# EAGLE design Schemat (EAGLE 9.1.0)
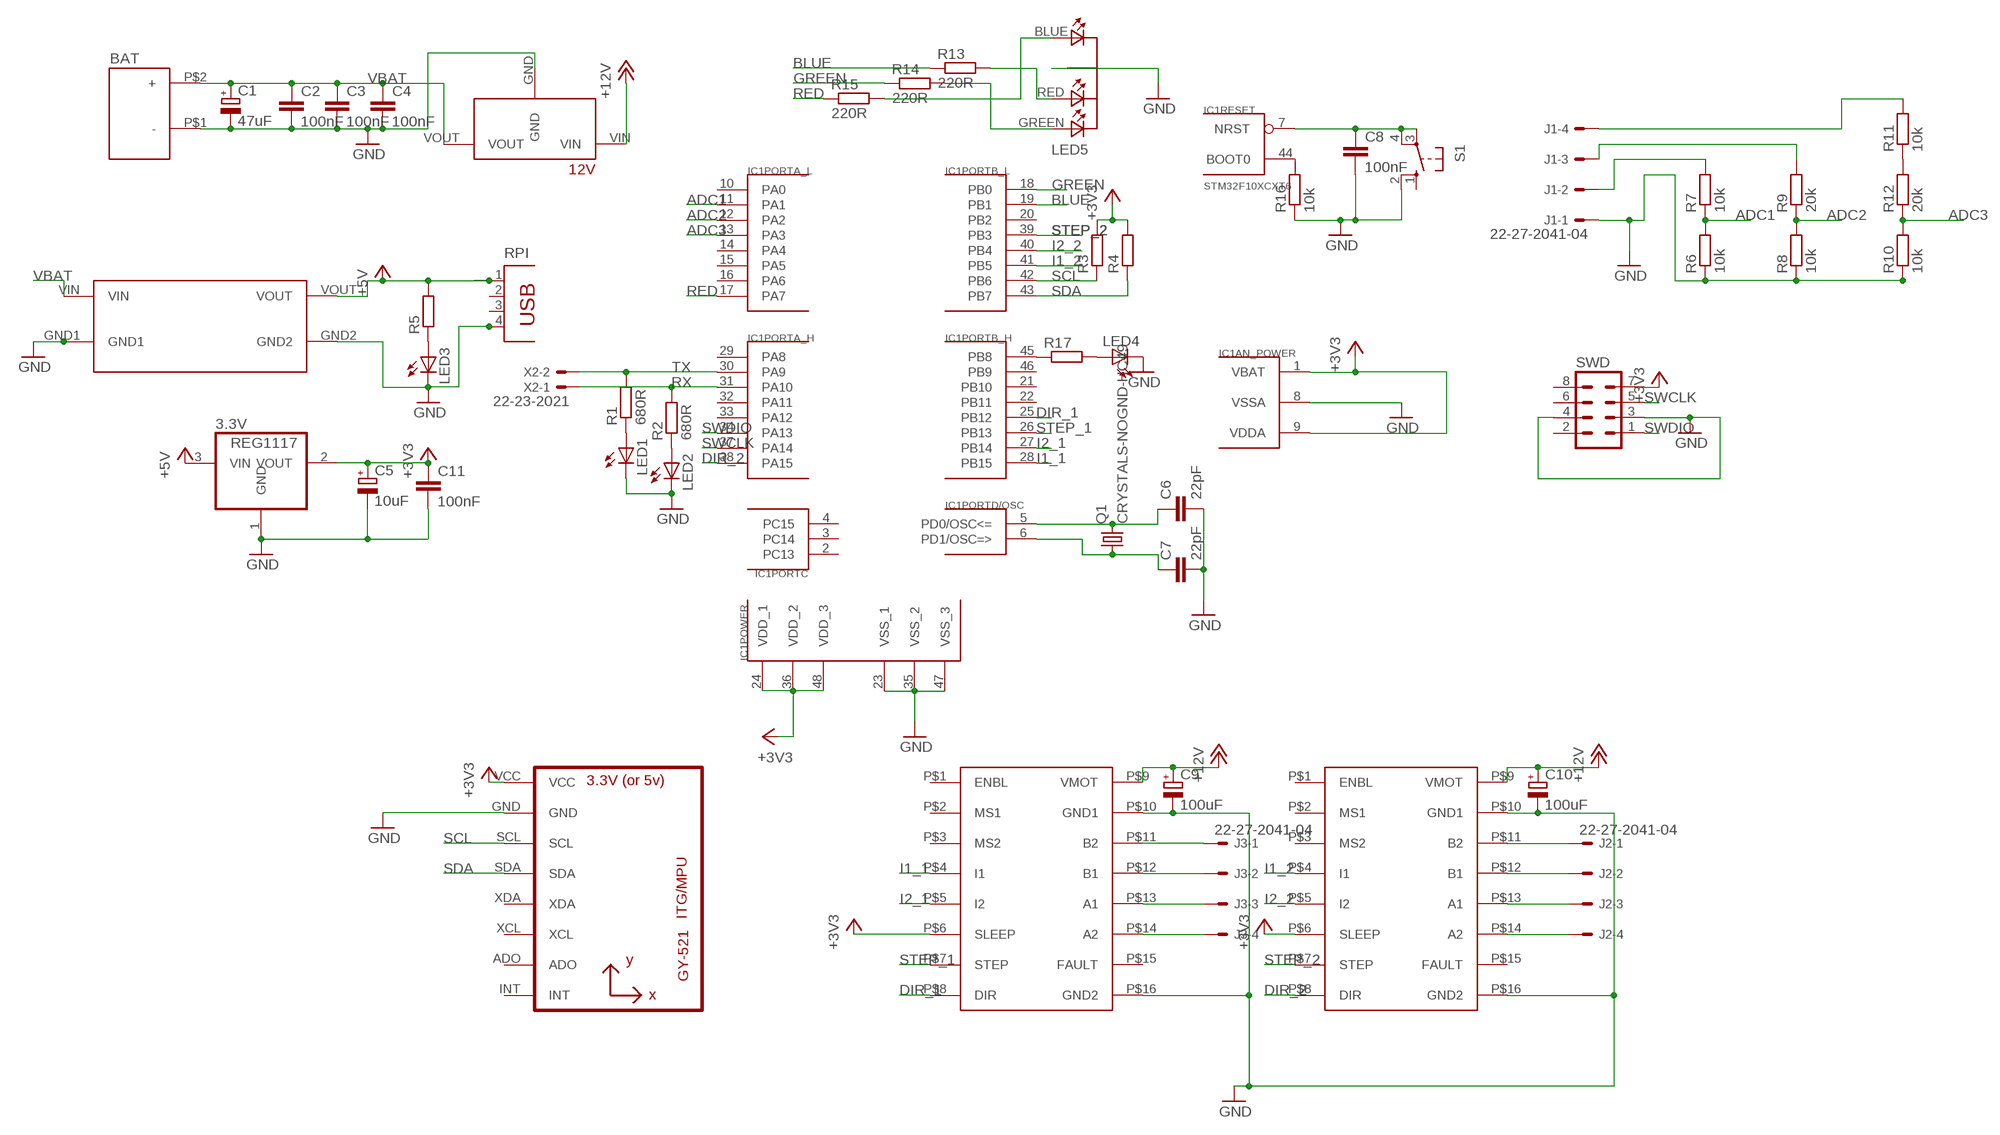
[diagram p0: schematic, sheet 1]

## Parts
3.3V  REG1117  [SOT223]
12V  12V_VOLTAGE_REGULATOR  9V_VOLTAGE_REGULATOR  [9V_VOLTAGE_REGULATOR]
BAT  DEANS  [DEAN]
C1  47uF  CPOL-EUE2-5  [E2-5]
C2  100nF  C-EUC0603K  [C0603K]
C3  100nF  C-EUC0603K  [C0603K]
C4  100nF  C-EUC0603K  [C0603K]
C5  10uF  CPOL-EUE2-5  [E2-5]
C6  22pF  C-EUC0603K  [C0603K]
C7  22pF  C-EUC0603K  [C0603K]
C8  100nF  C-EU050-030X075  [C050-030X075]
C9  100uF  CPOL-EUE2.5-7  [E2,5-7]
C10  100uF  CPOL-EUE2.5-7  [E2,5-7]
C11  100nF  C-EUC0603  [C0603]
DRV1  POLOLU-MP6500  [STEPPER-CARRIER]
DRV2  POLOLU-MP6500  [STEPPER-CARRIER]
IC1  STM32F10XCXT6  [TQFP48]
J1  22-27-2041-04  [6410-04]
J2  22-27-2041-04  [6410-04]
J3  22-27-2041-04  [6410-04]
LED1  LEDSML0603  [SML0603]
LED2  LEDSML0603  [SML0603]
LED3  LED5MM  [LED5MM]
LED4  LED5MM  [LED5MM]
LED5  LED-DIP-3  [DIP-4]
Q1  CRYSTALS-NOGND-HC49  [HC49]
R1  680R  R-EU_R0805  [R0805]
R2  680R  R-EU_R0805  [R0805]
R3  R-EU_R0805  [R0805]
R4  R-EU_R0805  [R0805]
R5  R-EU_R0805  [R0805]
R6  10k  R-EU_R0805  [R0805]
R7  10k  R-EU_R0805  [R0805]
R8  10k  R-EU_R0805  [R0805]
R9  20k  R-EU_R0805  [R0805]
R10  10k  R-EU_R0805  [R0805]
R11  10k  R-EU_R0805  [R0805]
R12  20k  R-EU_R0805  [R0805]
R13  220R  R-EU_R0805  [R0805]
R14  220R  R-EU_R0805  [R0805]
R15  220R  R-EU_R0805  [R0805]
R16  10k  R-EU_R0805  [R0805]
R17  R-EU_R0805  [R0805]
RPI  PN87520  [PN87520]
S1  10-XX  [B3F-10XX]
SWD  MA04-2  [MA04-2]
U1  GY-521MPU6050  [GY-521]
U$1  DC-DC  [DC-DC]
X2  22-23-2021  [22-23-2021]

## Nets
+3V3: 3.3V.2(VOUT) C5.+ C11.1 DRV1.P$6(SLEEP) DRV2.P$6(SLEEP) IC1.1(AN_POWER:VBAT) IC1.9(AN_POWER:VDDA) IC1.24(POWER:VDD_1) IC1.36(POWER:VDD_2) IC1.48(POWER:VDD_3) R3.2 R4.2 SWD.7 U1.VCC
+5V: 3.3V.3(VIN) R5.2 RPI.1 U$1.VOUT
+12V: 12V.VIN C9.+ C10.+ DRV1.P$9(VMOT) DRV2.P$9(VMOT)
ADC1: IC1.11(PORTA_L:PA1) R6.2 R7.1
ADC2: IC1.12(PORTA_L:PA2) R8.2 R9.1
ADC3: IC1.13(PORTA_L:PA3) R10.2 R12.1
BLUE: IC1.19(PORTB_L:PB1) R13.1
DIR_1: DRV1.P$8(DIR) IC1.25(PORTB_H:PB12)
DIR_2: DRV2.P$8(DIR) IC1.38(PORTA_H:PA15)
GND: 3.3V.1(GND) 12V.GND BAT.P$1(-) C1.- C2.2 C3.2 C4.2 C5.- C6.2 C7.2 C8.2 C9.- C10.- C11.2 DRV1.P$10(GND1) DRV1.P$16(GND2) DRV2.P$10(GND1) DRV2.P$16(GND2) IC1.8(AN_POWER:VSSA) IC1.23(POWER:VSS_1) IC1.35(POWER:VSS_2) IC1.47(POWER:VSS_3) J1.1 LED1.C LED2.C LED3.K(C) LED4.K(C) LED5.COMMON_CATHODE(COM-CATHODE) R6.1 R8.1 R10.1 R16.1 RPI.4 S1.2(S1) SWD.3 SWD.4 U1.GND U$1.GND1 U$1.GND2
GREEN: IC1.18(PORTB_L:PB0) R14.1
I1_1: DRV1.P$4(I1) IC1.28(PORTB_H:PB15)
I1_2: DRV2.P$4(I1) IC1.41(PORTB_L:PB5)
I2_1: DRV1.P$5(I2) IC1.27(PORTB_H:PB14)
I2_2: DRV2.P$5(I2) IC1.40(PORTB_L:PB4)
N$1: LED1.A R1.1
N$2: LED2.A R2.1
N$3: IC1.44(RESET:BOOT0) R16.2
N$4: C7.1 IC1.6(PORTD/OSC:PD1/OSC=>) Q1.1
N$5: LED5.GREEN R14.2
N$6: J1.2 R7.2
N$7: LED3.A R5.1
N$8: J1.3 R9.2
N$9: R11.1 R12.2
N$10: J1.4 R11.2
N$11: C8.1 IC1.7(RESET:NRST) S1.3(P) S1.4(P1)
N$13: IC1.45(PORTB_H:PB8) R17.1
N$14: LED4.A R17.2
N$15: LED5.RED R13.2
N$16: DRV2.P$11(B2) J2.1
N$17: LED5.BLUE R15.2
N$18: DRV1.P$12(B1) J3.2
N$19: DRV2.P$12(B1) J2.2
N$20: DRV2.P$13(A1) J2.3
N$21: DRV2.P$14(A2) J2.4
N$22: DRV1.P$11(B2) J3.1
N$23: DRV1.P$13(A1) J3.3
N$24: DRV1.P$14(A2) J3.4
N$26: C6.1 IC1.5(PORTD/OSC:PD0/OSC<=) Q1.2
RED: IC1.17(PORTA_L:PA7) R15.1
RX: IC1.31(PORTA_H:PA10) R2.2 X2.1
SCL: IC1.42(PORTB_L:PB6) R3.1 U1.SCL
SDA: IC1.43(PORTB_L:PB7) R4.1 U1.SDA
STEP_1: DRV1.P$7(STEP) IC1.26(PORTB_H:PB13)
STEP_2: DRV2.P$7(STEP) IC1.39(PORTB_L:PB3)
SWCLK: IC1.37(PORTA_H:PA14) SWD.5
SWDIO: IC1.34(PORTA_H:PA13) SWD.1
TX: IC1.30(PORTA_H:PA9) R1.2 X2.2
VBAT: 12V.VOUT BAT.P$2(+) C1.+ C2.1 C3.1 C4.1 U$1.VIN
Unconnected: DRV1.P$1(ENBL) DRV1.P$2(MS1) DRV1.P$3(MS2) DRV1.P$15(FAULT) DRV2.P$1(ENBL) DRV2.P$2(MS1) DRV2.P$3(MS2) DRV2.P$15(FAULT) IC1.2(PORTC:PC13) IC1.3(PORTC:PC14) IC1.4(PORTC:PC15) IC1.10(PORTA_L:PA0) IC1.14(PORTA_L:PA4) IC1.15(PORTA_L:PA5) IC1.16(PORTA_L:PA6) IC1.20(PORTB_L:PB2) IC1.21(PORTB_H:PB10) IC1.22(PORTB_H:PB11) IC1.29(PORTA_H:PA8) IC1.32(PORTA_H:PA11) IC1.33(PORTA_H:PA12) IC1.46(PORTB_H:PB9) RPI.2 RPI.3 S1.1(S) SWD.2 SWD.6 SWD.8 U1.ADO U1.INT U1.XCL U1.XDA

## Library data of the parts
3.3V = burr-brown:REG1117: 800mA and 1A Low Dropout (LDO) Positive Regulator 1.8V, 2.5V, 2.85V, 3.3V, 5V, and Adj; MPN: REG1117; OC_FARNELL: 1097566; OC_NEWARK: 14P6981
12V = Pololu Voltage Regulators:9V_VOLTAGE_REGULATOR: Polulu 9V Step-Up Voltage Regulator U3V12F9
BAT = DEANS:DEANS; BAT: BAT
C1 C5 C9 C10 = rcl:CPOL-EU: POLARIZED CAPACITOR, European symbol; SPICEPREFIX: C
C2-C4 C6-C8 C11 = rcl:C-EU: CAPACITOR, European symbol; SPICEPREFIX: C
DRV1 DRV2 = Pololu-MP6500:POLOLU-MP6500
IC1 = stm32:STM32F10XCXT6: ST STM32F101/103 48pin LQFP
J1-J3 = con-molex:22-?-04: CONNECTOR wire to board 2.54 mm (.1 inch) pitch header; MF: MOLEX; OC_FARNELL: unknown; OC_NEWARK: unknown
LED1-LED4 = led:LED: LED OSRAM: - CHIPLED LG R971, LG N971, LY N971, LG Q971, LY Q971, LO R971, LY R971 LH N974, LH R974 LS Q976, LO Q976, LY Q976 LO Q996 - Hyper CHIPLED LW Q18S LB Q993, LB Q99A, LB R99A - SideLED LS A670, LO A670, LY A670, LG A670, LP A670 LB A673, LV A673, LT A673, LW A673 LH A674 LY A675 LS A676, LA A676, LO A676, LY A676, LW A676 LS A679, LY A679, LG A679 - Hyper Micro SIDELED® LS Y876, LA Y876, LO Y876, LY Y876 LT Y87S - SmartLED LW L88C, LW L88S LB L89C, LB L89S, LG L890 LS L89K, LO L89K, LY L89K LS L896, LA L896, LO L896, LY L896 - TOPLED LS T670, LO T670, LY T670, LG T670, LP T670 LSG T670, LSP T670, LSY T670, LOP T670, LYG T670 LG T671, LOG T671, LSG T671 LB T673, LV T673, LT T673, LW T673 LH T674 LS T676, LA T676, LO T676, LY T676, LB T676, LH T676, LSB T676, LW T676 LB T67C, LV T67C, LT T67C, LS T67K, LO T67K, LY T67K, LW E67C LS E67B, LA E67B, LO E67B, LY E67B, LB E67C, LV E67C, LT E67C LW T67C LS T679, LY T679, LG T679 LS T770, LO T770, LY T770, LG T770, LP T770 LB T773, LV T773, LT T773, LW T773 LH T774 LS E675, LA E675, LY E675, LS T675 LS T776, LA T776, LO T776, LY T776, LB T776 LHGB T686 LT T68C, LB T68C - Hyper Mini TOPLED® LB M676 - Mini TOPLED Santana® LG M470 LS M47K, LO M47K, LY M47K Source: http://www.osram.convergy.de LUXEON: - LUMILED® LXK2-PW12-R00, LXK2-PW12-S00, LXK2-PW14-U00, LXK2-PW14-V00 LXK2-PM12-R00, LXK2-PM12-S00, LXK2-PM14-U00 LXK2-PE12-Q00, LXK2-PE12-R00, LXK2-PE12-S00, LXK2-PE14-T00, LXK2-PE14-U00 LXK2-PB12-K00, LXK2-PB12-L00, LXK2-PB12-M00, LXK2-PB14-N00, LXK2-PB14-P00, LXK2-PB14-Q00 LXK2-PR12-L00, LXK2-PR12-M00, LXK2-PR14-Q00, LXK2-PR14-R00 LXK2-PD12-Q00, LXK2-PD12-R00, LXK2-PD12-S00 LXK2-PH12-R00, LXK2-PH12-S00 LXK2-PL12-P00, LXK2-PL12-Q00, LXK2-PL12-R00 Source: www.luxeon.com KINGBRIGHT: KA-3528ASYC Source: www.kingbright.com
LED5 = _led-rgb:LED-DIP-3: RGB DIP LED Edited: brunql DIP 4 Pin Special for AmbilightUSB
Q1 = IQD-Frequency-Products:CRYSTALS-NOGND: CRYSTALS CAN NOT GROUNDED
R1-R17 = rcl:R-EU_: RESISTOR, European symbol; SPICEPREFIX: R
RPI = con-berg:PN87520: BERG USB connector; OC_FARNELL: unknown; OC_NEWARK: unknown
S1 = switch-omron:10-XX: OMRON SWITCH; MPN: B3F-1000; OC_FARNELL: 176432; OC_NEWARK: 36M3542
SWD = con-lstb:MA04-2: PIN HEADER; OC_FARNELL: unknown; OC_NEWARK: unknown
U1 = gy-521:GY-521
U$1 = DC-DC:DC-DC
X2 = con-molex:22-23-2021: .100" (2.54mm) Center Header - 2 Pin; MF: MOLEX; MPN: 22-23-2021; OC_FARNELL: 1462926; OC_NEWARK: 25C3832

## Board
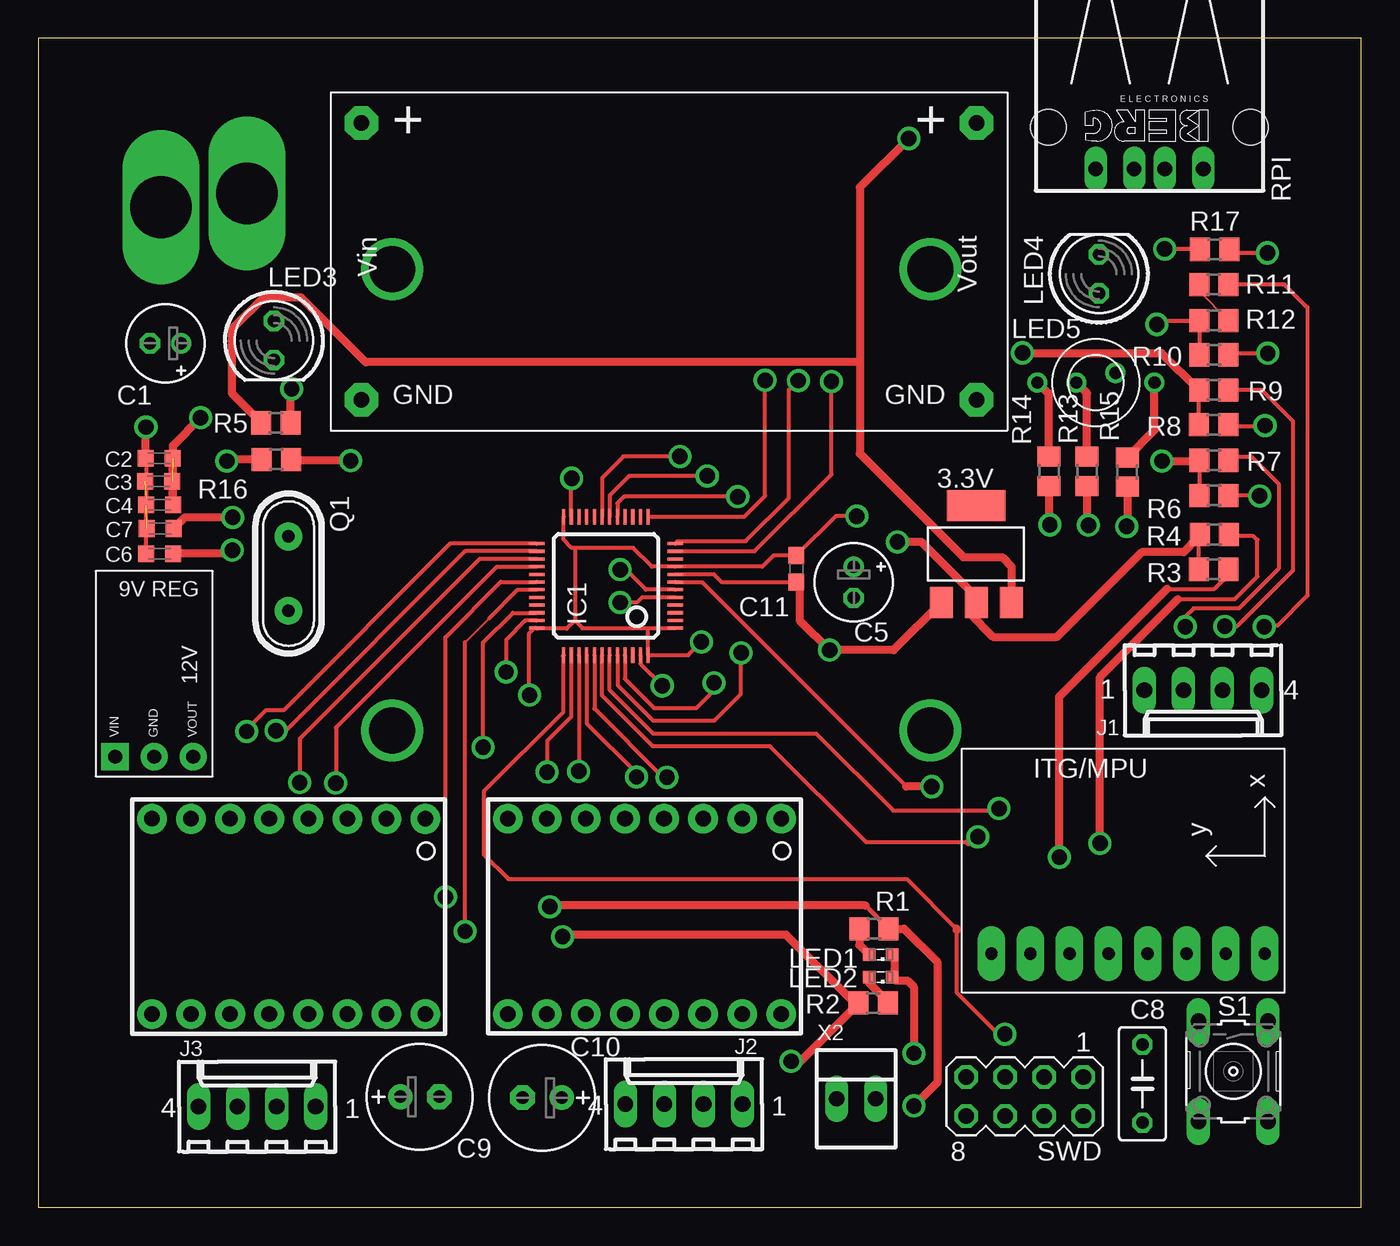
[diagram p1: board, top side]
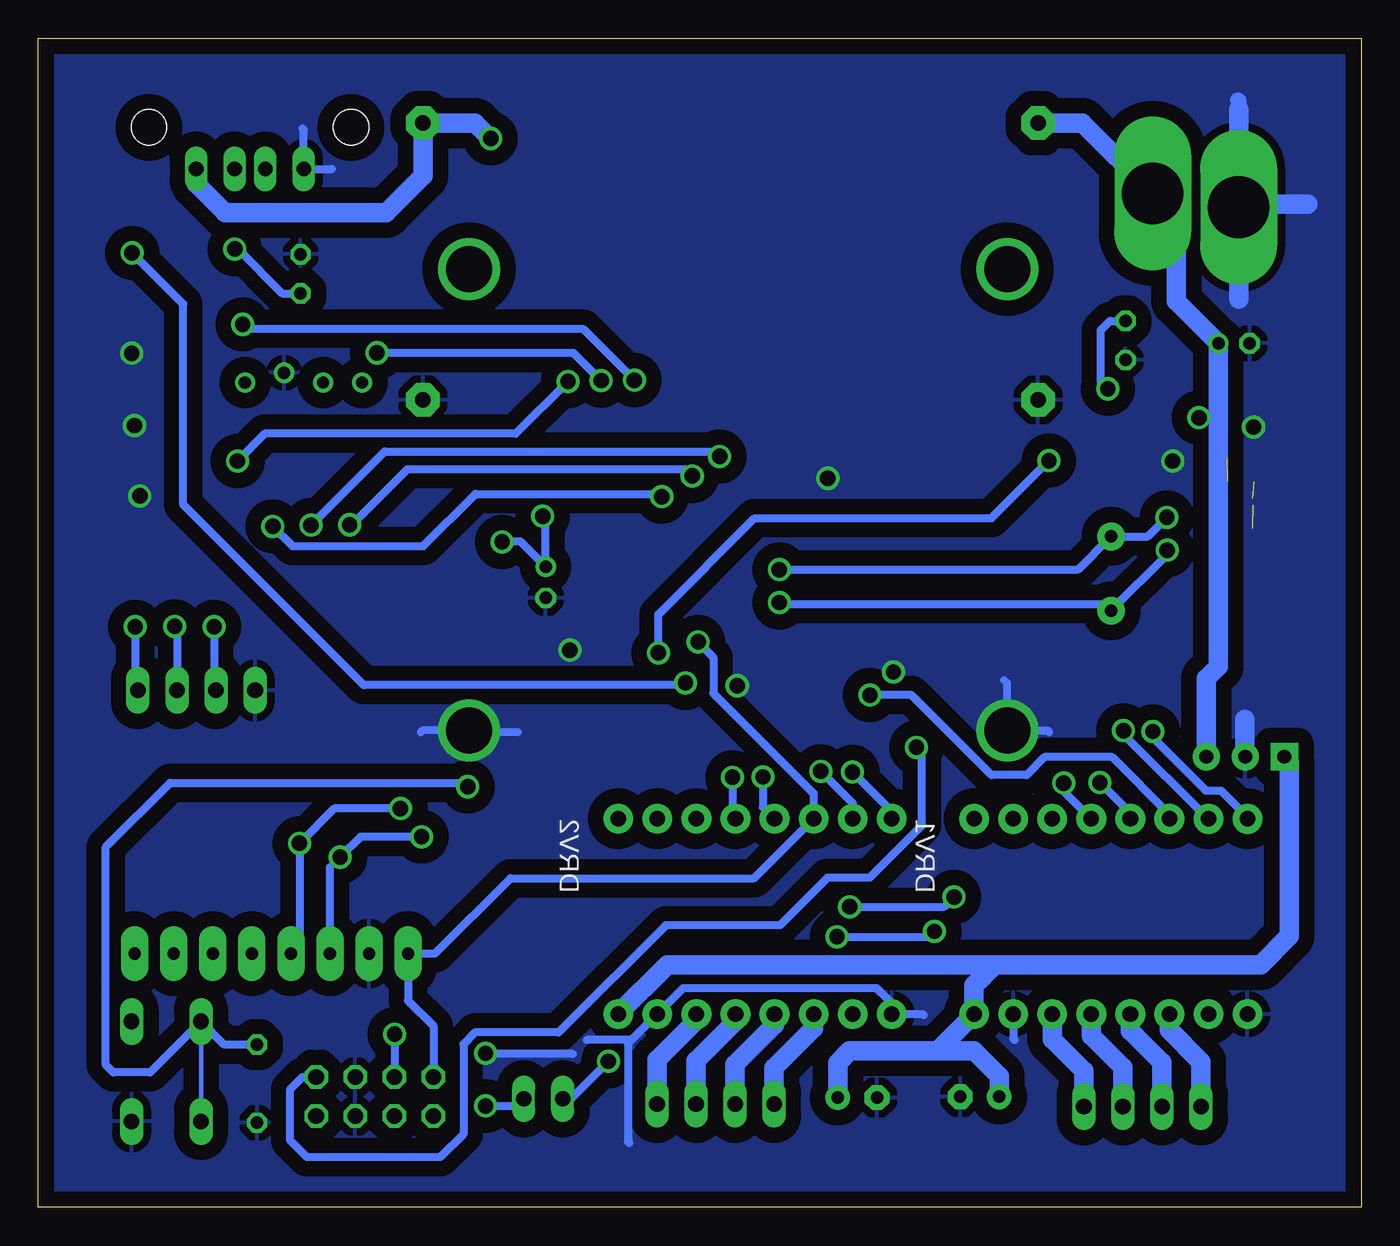
[diagram p2: board, bottom side, seen from below]

Size 86 x 76 mm. Coordinates in mm from the lower left corner, seen from the top.
Outline: 0,0 86,0 86,76 0,76 0,0
Copper layers (1*16): Top 0.035mm / dielectric 1.5mm / Bottom 0.035mm
Design rules "default *": minimum track width 6mil, minimum drill 0.35mm, track to track 10mil, track to pad 6mil, pad to pad 6mil, via to via 6mil, smd to smd 6mil, copper to edge 40mil, drill to drill 6mil, minimum pad ring 10mil, minimum via ring 8mil, stop-mask expansion 4mil, vias tented up to drill 0mil, thermal gap 20mil

### Footprints (pad centres in the part's own frame; a part is rotated, then mirrored left to right if it is on the bottom)
SOT223 = smd 1.499 x 2.007: 1 -2.261,-3.15; 2 0.025,-3.15; 3 2.311,-3.15 | smd 3.81 x 2.007: 4 0,3.15
9V_VOLTAGE_REGULATOR = drill 0.9 pad 1.778: GND 0,-1.27; VOUT 2.54,-1.27 | drill 0.9 pad 1.778 square: VIN -2.54,-1.27
DEAN = drill 4 long: P$1 0.9,-0.1; P$2 0,5.5
E2-5 = drill 0.813 pad 1.27: + -1.016,0 | drill 0.813 pad 1.27 octagon: - 1.016,0
C0603K = smd 1.05 x 1.08: 1 -0.875,0; 2 0.875,0
C050-030X075 = drill 0.813 octagon: 1 -2.54,0; 2 2.54,0
E2,5-7 = drill 0.813 pad 1.6: + -1.27,0 | drill 0.813 pad 1.6 octagon: - 1.27,0
C0603 = smd 1.1 x 1: 1 -0.85,0; 2 0.85,0
STEPPER-CARRIER = drill 1.016 pad 1.93: P$1 -3.81,5.08; P$2 -3.81,2.54; P$3 -3.81,0; P$4 -3.81,-2.54; P$5 -3.81,-5.08; P$6 -3.81,-7.62; P$7 -3.81,-10.16; P$8 -3.81,-12.7; P$9 8.89,5.08; P$10 8.89,2.54; P$11 8.89,0; P$12 8.89,-2.54; P$13 8.89,-5.08; P$14 8.89,-7.62; P$15 8.89,-10.16; P$16 8.89,-12.7
TQFP48 = smd 0.2 x 1: 1 -2.75,-4.5; 2 -2.25,-4.5; 3 -1.75,-4.5; 4 -1.25,-4.5; 5 -0.75,-4.5; 6 -0.25,-4.5; 7 0.25,-4.5; 8 0.75,-4.5; 9 1.25,-4.5; 10 1.75,-4.5; 11 2.25,-4.5; 12 2.75,-4.5; 25 2.75,4.5; 26 2.25,4.5; 27 1.75,4.5; 28 1.25,4.5; 29 0.75,4.5; 30 0.25,4.5; 31 -0.25,4.5; 32 -0.75,4.5; 33 -1.25,4.5; 34 -1.75,4.5; 35 -2.25,4.5; 36 -2.75,4.5 | smd 1 x 0.2: 13 4.5,-2.75; 14 4.5,-2.25; 15 4.5,-1.75; 16 4.5,-1.25; 17 4.5,-0.75; 18 4.5,-0.25; 19 4.5,0.25; 20 4.5,0.75; 21 4.5,1.25; 22 4.5,1.75; 23 4.5,2.25; 24 4.5,2.75; 37 -4.5,2.75; 38 -4.5,2.25; 39 -4.5,1.75; 40 -4.5,1.25; 41 -4.5,0.75; 42 -4.5,0.25; 43 -4.5,-0.25; 44 -4.5,-0.75; 45 -4.5,-1.25; 46 -4.5,-1.75; 47 -4.5,-2.25; 48 -4.5,-2.75
6410-04 = drill 1.016 long: 1 3.81,0; 2 1.27,0; 3 -1.27,0; 4 -3.81,0
SML0603 = smd 0.8 x 0.8: A 0.75,0; C -0.75,0
LED5MM = drill 0.813 octagon: A -1.27,0; K 1.27,0
DIP-4 = drill 0.8: BLUE 0,5.08; COMMON_CATHODE -0.635,2.54; GREEN 0,-2.54; RED 0,0
HC49 = drill 0.813 pad 1.8: 1 -2.413,0; 2 2.413,0
R0805 = smd 1.3 x 1.5: 1 -0.95,0; 2 0.95,0
PN87520 = drill 0.95 long: 1 -3.5,2.71; 2 -1,2.71; 3 1,2.71; 4 3.5,2.71 | hole 2.3: -6.57,0; 6.57,0
B3F-10XX = drill 1.016 long: 1 -3.251,2.261; 2 3.251,2.261; 3 -3.251,-2.261; 4 3.251,-2.261
MA04-2 = drill 1.016 octagon: 1 -3.81,-1.27; 2 -3.81,1.27; 3 -1.27,-1.27; 4 -1.27,1.27; 5 1.27,-1.27; 6 1.27,1.27; 7 3.81,-1.27; 8 3.81,1.27
GY-521 = drill 0.8 pad 1.778 long: ADO -8.89,-6.35; GND -8.89,6.35; INT -8.89,-8.89; SCL -8.89,3.81; SDA -8.89,1.27; VCC -8.89,8.89; XCL -8.89,-3.81; XDA -8.89,-1.27
DC-DC = drill 1 pad 2.184 octagon: GND1 -20,-9; GND2 20,-9; VIN -20,9; VOUT 20,9
22-23-2021 = drill 1 long: 1 -1.27,0; 2 1.27,0

### Placement (x,y rotation side)
3.3V  60.96,42.46 0 top
12V  7.52,30.56 0 top
BAT  8.05,65.93 270 top
C1  8.26,56.18 180 top
C2  7.85,48.7 180 top
C3  7.82,47.2 180 top
C4  7.88,45.67 180 top
C5  53.01,40.63 270 top
C6  7.89,42.49 180 top
C7  7.91,44.13 180 top
C8  71.78,8.03 270 top
C9  24.79,7.18 0 top
C10  32.75,7.12 180 top
C11  49.27,41.51 270 top
DRV1  20.08,21.44 270 top
DRV2  43.22,21.45 270 top
IC1  36.9,40.4 90 top
J1  75.72,33.61 180 top
J2  41.97,6.7 0 top
J3  14.22,6.54 0 top
LED1  54.77,16.42 180 top
LED2  54.77,14.96 180 top
LED3  15.32,56.36 270 top
LED4  68.95,60.69 90 top
LED5  67.49,53.62 270 top
Q1  16.26,41.2 270 top
R1  54.33,18.11 0 top
R2  54.28,13.28 180 top
R3  76.41,41.48 180 top
R4  76.46,43.74 180 top
R5  15.45,51.01 180 top
R6  76.43,46.28 180 top
R7  76.43,48.57 0 top
R8  76.41,50.88 180 top
R9  76.42,53.14 0 top
R10  76.43,55.43 180 top
R11  76.42,60 0 top
R12  76.43,57.66 0 top
R13  68.18,47.86 90 top
R14  65.71,47.86 90 top
R15  70.79,47.81 90 top
R16  15.47,48.62 0 top
R17  76.48,62.28 180 top
RPI  72.24,70.22 180 top
S1  77.69,8.83 270 top
SWD  64.13,7.2 180 top
U1  70.85,25.38 90 top
U$1  41,61.5 0 top
X2  53.18,7.05 0 top

### Tracks (layer width: path | path; a pad name or v marks a point on that pad's centre or on a via)
+3V3  (via drill 1)
  Top 0.152: 49.8,42.89 C11.1
  Top 0.254: 75.48,41.35 R3.2 75.46,43.34 75.33,43.47 75.51,43.64 R4.2 | 60.53,38.63 60.53,38.86 3.3V.2 60.99,39.67 | IC1.24 34.15,43.41 34.67,42.88 34.88,42.88 | 34.88,42.88 38.66,42.88 39.88,41.66 41.37,41.66 IC1.9 47.07,41.66 47.78,42.36 C11.1 51.84,44.94 v53.22,44.94 | 34.88,42.88 34.88,38.15 | 34.88,38.15 34.34,37.62 32.43,37.62 IC1.36 32.27,37.66 31.88,37.27 31.88,33.35 v31.93,33.3 | 34.88,38.15 35.38,37.66 39.68,37.66 | 39.68,37.66 IC1.1 | 39.68,37.66 39.65,37.62 IC1.48 42.25,35.91 v43.11,36.76
  Top 0.508: 60.53,38.63 62.07,37.09 66.24,37.09 71.75,42.6 74.47,42.6 75.33,43.47 | 60.99,39.67 57.4,43.26 v55.86,43.26
  Bottom 0.254: 61.96,15.84 U1.VCC | 12.46,25.54 DRV1.P$6 | 53.01,44.73 v53.22,44.94 | v55.86,43.26 55.81,43.31
  Bottom 0.508: v31.93,33.3 29.22,33.3 24.03,28.11 21.73,28.11 20.58,29.26 16.18,29.26 12.46,25.54 | 55.81,43.31 54.68,43.31 C5.+ 53.01,44.73 | v43.11,36.76 42.11,35.76 42.11,33.42 35.6,26.91 DRV2.P$6 39.47,21.39 55.32,21.39 60.22,16.49 U1.VCC 61.96,13.43 60.32,11.78 SWD.7
+5V  (via drill 1)
  Top 0.508: v56.59,69.5 53.41,66.31 53.41,54.94 | 53.41,54.94 53.41,49 60.14,42.27 62.66,42.27 63.27,41.66 3.3V.3 | 53.41,54.94 21.29,54.94 17.07,59.16 14.63,59.16 12.58,57.1 12.58,52.93 R5.2
  Bottom 0.254: 56.62,69.52 v56.59,69.5
  Bottom 1.27: v56.59,69.5 57.6,70.5 U$1.VOUT 61,67.07 63.4,64.67 73.87,64.67 75.74,66.55 RPI.1
+12V
  Bottom 1.27: DRV2.P$9 45.09,15.76 23.82,15.76 | 23.82,15.76 6.52,15.76 4.65,17.63 4.65,28.96 12V.VIN | 27.55,10.16 DRV1.P$9 25.16,14.42 24.57,15.01 24.07,15.51 23.82,15.76 | 27.55,10.16 33.25,10.16 34.02,9.4 C10.+ | 27.55,10.16 25.16,10.16 23.52,8.52 C9.+
ADC1  (via drill 1)
  Top 0.254: R6.2 R7.1 75.43,48.52 | IC1.11 46.57,42.66 51.56,47.65 v51.56,53.7
  Top 0.508: v73.05,48.52 75.43,48.52
  Bottom 0.508: v51.56,53.7 54.97,50.3 71.28,50.3 v73.05,48.52
ADC2  (via drill 1)
  Top 0.152: 75.46,53.12 R9.1
  Top 0.254: R8.2 75.46,53.12 | v49.41,53.75 48.8,53.14 48.8,46.13 45.97,43.31 41.55,43.31 IC1.12
  Top 0.508: v63.98,55.55 73.03,55.55 75.46,53.12
  Bottom 0.508: v49.41,53.75 51.21,55.55 v63.98,55.55
ADC3  (via drill 1)
  Top 0.254: R10.2 R12.1 72.98,57.66 v72.72,57.41 | IC1.13 45.9,44.91 47.25,46.26 v47.25,53.77
  Bottom 0.508: v47.25,53.77 50.6,57.13 72.44,57.13 v72.72,57.41
BLUE  (via drill 1)
  Top 0.254: 68.18,44.45 v68.28,44.35 | v41.71,48.82 38.04,48.82 36.65,47.43 IC1.19
  Top 0.508: R13.1 68.18,44.45
  Bottom 0.508: v68.28,44.35 63.48,49.15 42.04,49.15 v41.71,48.82
DIR_1  (via drill 1)
  Top 0.254: v13.54,30.94 13.54,31.07 14.79,32.31 15.93,32.31 26.77,43.16 IC1.25
  Bottom 0.254: 7.38,25.36 DRV1.P$8
  Bottom 0.508: v13.54,30.94 13.54,30.54 10.1,27.1 9.12,27.1 7.38,25.36
DIR_2  (via drill 1)
  Top 0.254: IC1.38 34.65,31.89 33.07,30.32 v33.07,28.3
  Bottom 0.254: 30.52,25.74 DRV2.P$8
  Bottom 0.508: v33.07,28.3 30.52,25.74
GND  (via drill 1, 3)  (2 unrouted)
  Top 0.152: C4.2 7.04,45.71 7.04,46.08
  Top 0.254: R8.1 77.43,50.8 79.73,50.8 v79.76,50.83 | v79.4,46.26 79.38,46.28 R6.1 | IC1.35 32.38,38.14 31.66,38.14 30.41,36.89 v30.41,34.8 | 49.5,40.44 C11.2 44.4,40.66 43.91,41.16 IC1.8 | v79.94,55.53 77.48,55.53 R10.1 | IC1.23 34.65,47.37 v34.67,47.4 | C6.2 7.01,46.05 7.04,46.08 7.04,48.63 C2.2 | 12.35,48.62 v12.25,48.52 | IC1.47 39.15,35.33 v40.56,33.91 | 6.97,50.71 v6.99,50.73
  Top 0.508: C2.2 6.97,50.71 | R16.1 12.35,48.62 | 49.5,40.44 49.5,38.16 v51.44,36.22 55.61,36.22 3.3V.1 | LED1.C 55.66,16.28 55.66,14.96 LED2.C 55.73,14.75 56.5,14.75 56.93,14.32 v56.93,10.01
  Bottom 0.508: 23.19,34.27 23,34.07 v23,31 20.38,31 20.27,30.89 | 54.82,30.89 57.89,30.89 v58,31 61.03,31 61.14,30.89 | BAT.P$1 4.07,65.03 3.96,64.92 | 47.45,10.87 47.68,10.64 47.68,4.27 47.58,4.17 | 47.45,10.87 DRV2.P$10 44.07,14.25 31.5,14.25 30.52,13.27 DRV2.P$16 28.51,12.56 28.45,12.5 | v56.93,10.01 56.93,9.83 56.8,9.96 51.26,9.96 | 47.45,10.87 50.35,10.87 | DRV1.P$10 22.62,10.96 22.53,10.87 | 68.84,70.16 68.74,70.06 RPI.4 66.94,67.51 66.93,67.52
  Bottom 1.016: 7.95,71.35 7.95,71.95 8,72
  Bottom 1.27: BAT.P$1 7.95,71.35 | BAT.P$1 7.95,59.06 | BAT.P$1 7.75,65.23 3.46,65.23 | 12V.GND 7.55,29.31 7.55,31.7
  pour Bottom (isolate 1): 0,76 86,76 86,0 0,0
GREEN  (via drill 1)
  Top 0.254: 65.71,44.43 v65.76,44.38 | v43.49,47.55 38.41,47.55 37.15,46.29 IC1.18
  Top 0.508: R14.1 65.71,44.43
  Bottom 0.254: v65.76,44.38 65.61,44.38 | 43.92,47.98 v43.49,47.55
  Bottom 0.508: 65.61,44.38 62,47.98 43.92,47.98
I1_1  (via drill 1)
  Top 0.254: IC1.28 29.81,41.66 19.34,31.18 19.34,27.59 v19.33,27.58
  Bottom 0.508: v19.33,27.58 19.33,27.04 DRV1.P$4
I1_2  (via drill 1)
  Top 0.254: IC1.41 36.15,32.42 40.62,27.95 v40.87,27.95
  Bottom 0.254: 40.87,25.45 DRV2.P$4
  Bottom 0.508: v40.87,27.95 40.87,25.45
I2_1  (via drill 1)
  Top 0.254: IC1.27 28.69,42.16 16.98,30.45 v16.98,27.61
  Bottom 0.508: v16.98,27.61 15,25.62 DRV1.P$5
I2_2  (via drill 1)
  Top 0.254: IC1.40 35.65,31.47 38.89,28.23 v38.89,27.98
  Bottom 0.508: v38.89,27.98 38.89,26.01 DRV2.P$5
N$1
  Top 0.254: R1.1 53.38,17.93
  Top 0.508: 53.38,17.93 53.38,17.05 LED1.A
N$2
  Top 0.254: 54.98,13.53 R2.1
  Top 0.508: LED2.A 54.02,14.57 55.23,13.36 R2.1
N$3  (via drill 1)
  Top 0.254: IC1.44 37.66,33.95 39.96,31.65 43.95,31.65 45.68,33.38 45.68,36.29 45.68,36.06 v45.69,36.05 | 16.5,48.54 R16.2
  Top 0.508: v20.3,48.54 16.5,48.54
  Bottom 0.508: v20.3,48.54 24.03,44.81 39.43,44.81 45.69,38.55 v45.69,36.05
N$4  (via drill 1)
  Top 0.254: IC1.6 39.51,40.16 38.2,41.46 v37.82,41.46
  Top 0.508: v12.63,44.86 9.52,44.86 C7.1
  Bottom 0.254: v37.82,41.46 37.8,41.48
  Bottom 0.508: 37.8,41.48 18.39,41.48 Q1.1 13.87,43.62 v12.63,44.86
N$5
  Top 0.508: R14.2 65.71,52.86 LED5.GREEN
N$6  (via drill 1)
  Top 0.254: R7.2 77.58,48.77 78.9,48.77 80.65,47.03 80.65,41.52 78.06,38.94 75.11,38.94 74.58,38.41 v74.58,37.75
  Bottom 0.254: 74.58,33.73 J1.2
  Bottom 0.508: v74.58,37.75 74.58,33.73
N$7  (via drill 1)
  Top 0.152: R5.1 16.49,51.1
  Top 0.254: 16.4,53.15 v16.46,53.22
  Top 0.508: R5.1 16.4,53.15
  Bottom 0.254: v16.46,53.22 16.92,53.67
  Bottom 0.508: 16.92,53.67 16.92,57.03 16.32,57.63 LED3.A
N$8  (via drill 1)
  Top 0.254: R9.2 79.53,53.14 81.56,51.11 81.56,41.41 77.93,37.77 v77.14,37.77
  Bottom 0.254: v77.14,37.77 76.99,37.62
  Bottom 0.508: 76.99,37.62 J1.3
N$9
  Top 0.152: R11.1 75.47,59.57 R12.2
N$10  (via drill 1)
  Top 0.254: R11.2 81.01,60 82.52,58.5 82.52,39.77 80.57,37.82 79.78,37.82 v79.71,37.75
  Bottom 0.254: 79.71,33.78 J1.4
  Bottom 0.508: v79.71,37.75 79.71,33.78
N$11  (via drill 1)
  Top 0.254: IC1.7 43.13,40.64 56.43,27.34
  Top 0.508: v58.08,27.34 56.43,27.34
  Bottom 0.254: v58.08,27.34 58.34,27.6
  Bottom 0.305: S1.4 S1.3
  Bottom 0.508: C8.1 73.92,10.57 S1.3 78.75,8.77 81.13,8.77 81.61,9.25 81.61,23.42 77.44,27.6 58.34,27.6
N$13  (via drill 1)
  Top 0.254: v79.91,62.05 77.66,62.05 R17.1 | IC1.45 38.14,34.35 40.03,32.46 42.79,32.46 43.93,33.6 v43.93,34.1
  Bottom 0.508: v79.91,62.05 76.58,58.73 76.58,45.69 64.84,33.94 43.93,33.94 v43.93,34.1
N$14  (via drill 1)
  Top 0.254: R17.2 73.26,62.28 v73.23,62.31
  Bottom 0.254: v73.23,62.31 73.03,62.31
  Bottom 0.508: 73.03,62.31 70.14,59.42 LED4.A
N$15
  Top 0.508: R13.2 68.18,52.94 LED5.RED
N$16
  Bottom 1.27: DRV2.P$11 43.22,12.16 45.78,9.6 J2.1
N$17
  Top 0.508: R15.2 72.57,50.53 LED5.BLUE
N$18
  Bottom 1.27: DRV1.P$12 17.54,11.14 15.49,9.09 J3.2
N$19
  Bottom 1.27: J2.2 43.24,9.51 40.68,12.08 DRV2.P$12
N$20
  Bottom 1.27: DRV2.P$13 38.14,11.86 40.7,9.29 J2.3
N$21
  Bottom 1.27: DRV2.P$14 35.6,11.63 38.16,9.06 J2.4
N$22
  Bottom 1.27: DRV1.P$11 20.08,10.93 18.03,8.88 J3.1
N$23
  Bottom 1.27: DRV1.P$13 15,11.47 12.95,9.42 J3.3
N$24
  Bottom 1.27: DRV1.P$14 12.46,11.52 10.41,9.47 J3.4
N$26  (via drill 1)
  Top 0.254: IC1.5 39.25,39.66 38.92,39.32 v37.82,39.32 | v12.6,42.73 12.37,42.49
  Top 0.508: 12.37,42.49 C6.1
  Bottom 0.254: 16.69,39.22 Q1.2 | v37.82,39.32 37.72,39.22 | 12.6,42.45 v12.6,42.73
  Bottom 0.508: 37.72,39.22 16.69,39.22 | Q1.2 12.6,42.45
N$27  (via drill 3)
  Bottom 0.508: v23,61 22.89,61.12
N$28  (via drill 3)
  Bottom 0.508: v58,61 57.88,61.12
RED  (via drill 1)
  Top 0.254: 70.79,44.3 v70.77,44.27 | v45.47,46.2 38.08,46.2 37.65,45.77 IC1.17
  Top 0.508: R15.1 70.79,44.3
  Bottom 0.508: v70.77,44.27 69.47,42.98 60.99,42.98 57.59,46.38 45.65,46.38 v45.47,46.2
RX  (via drill 1)
  Top 0.152: R2.2 52.86,12.81 | 27.74,36.73 29.3,38.29
  Top 0.254: 29.3,38.29 31.17,40.16 IC1.31 | v27.74,17.94 27.74,36.73 | R2.2 53.05,13.28
  Top 0.305: 34.22,17.72 v34.08,17.58
  Top 0.508: 53.05,13.28 48.62,17.72 34.22,17.72 | 52.86,12.81 49.53,9.48 v48.94,9.48
  Bottom 0.152: 28.09,17.58 v27.74,17.94
  Bottom 0.508: v34.08,17.58 28.09,17.58 | X2.1 51.38,7.05 v48.94,9.48
SCL  (via drill 1)
  Top 0.152: 77.93,41.38 77.55,41.38 77.46,41.38 R3.1
  Top 0.254: IC1.42 36.65,33.28 39.96,29.98 47.58,29.98 53.81,23.75 60.49,23.75 | 73.38,40.21 76.47,40.21 77.55,41.29 77.55,41.38 | 60.84,24.09 v61.09,24.09
  Top 0.508: v66.38,22.76 66.38,33.21 73.38,40.21 | 60.49,23.75 60.84,24.09
  Bottom 0.254: 67.04,22.1 v66.38,22.76
  Bottom 0.508: v61.09,24.09 65.06,24.09 v66.38,22.76 | U1.SCL 67.04,22.1
SDA  (via drill 1)
  Top 0.254: 74.09,39.55 77.79,39.55 79.26,41.02 79.26,43.39 79.01,43.64 77.51,43.64 R4.1 | IC1.43 37.14,35.9 37.14,33.63 39.98,30.79 50.58,30.79 55.58,25.79 62.32,25.79 v62.46,25.92
  Top 0.508: v69.02,23.67 69.02,34.48 74.09,39.55
  Bottom 0.508: v62.46,25.92 66.77,25.92 v69.02,23.67 69.02,17.05 U1.SDA
STEP_1  (via drill 1)
  Top 0.254: IC1.26 27.75,42.66 16.09,30.99 v15.45,30.99
  Bottom 0.254: v15.45,30.99 15.45,30.75 | 9.95,25.25 DRV1.P$7
  Bottom 0.508: 15.45,30.75 9.95,25.25
STEP_2  (via drill 1)
  Top 0.254: IC1.39 35.15,28.36 v35.13,28.35
  Bottom 0.508: v35.13,28.35 33.06,26.28 DRV2.P$7
SWCLK  (via drill 1)
  Top 0.254: IC1.37 34.1,35.86 34.1,32.16 28.96,27.02 28.96,22.94 30.56,21.34 56.47,21.34 59.69,18.11 | 62.41,11.26 59.69,13.97 59.69,18.01
  Top 0.508: 59.69,18.11 59.69,18.09 59.69,18.01 | 62.41,11.26 v62.84,11.26
  Bottom 0.508: v62.84,11.26 62.84,8.49 SWD.5
SWDIO  (via drill 1)
  Top 0.254: v28.91,29.91 28.91,36.71 30.86,38.66 IC1.34
  Bottom 0.254: 28.55,29.55 v28.91,29.91
  Bottom 0.508: 28.55,29.55 28.55,24.82 31.96,21.41 34.7,21.41 37.78,18.34 45.21,18.34 51.94,11.6 52.19,11.36 57.61,11.36 58.37,10.59 58.37,4.75 59.87,3.25 68.53,3.25 69.62,4.35 69.62,7.67 68.82,8.47 SWD.1
TX  (via drill 1)
  Top 0.152: 33.33,19.61 v33.25,19.54
  Top 0.254: v26.47,20.17 26.47,37.06 30.06,40.66 IC1.30 | 54.52,7.05 X2.2
  Top 0.305: R1.2 53.78,19.61
  Top 0.508: 53.78,19.61 33.33,19.61 | v56.92,6.58 58.45,8.11 58.45,15.94 56.28,18.11 R1.2
  Bottom 0.508: v33.25,19.54 27.11,19.54 v26.47,20.17 | v56.92,6.58 54.91,6.58 X2.2
VBAT  (via drill 1)  (1 unrouted)
  Top 0.508: C2.1 8.72,45.7 C4.1 8.75,49.54 v10.54,51.34
  Bottom 0.254: v10.54,51.34 9.33,51.34 9.28,51.39
  Bottom 1.27: 12V.VOUT 10.06,34.37 9.28,35.15 9.28,51.39 C1.+ 12,58.9 12,64.38 BAT.P$2 18.12,70.5 U$1.VIN